# EAGLE design M12-Signalinverter (EAGLE 7.7.0)
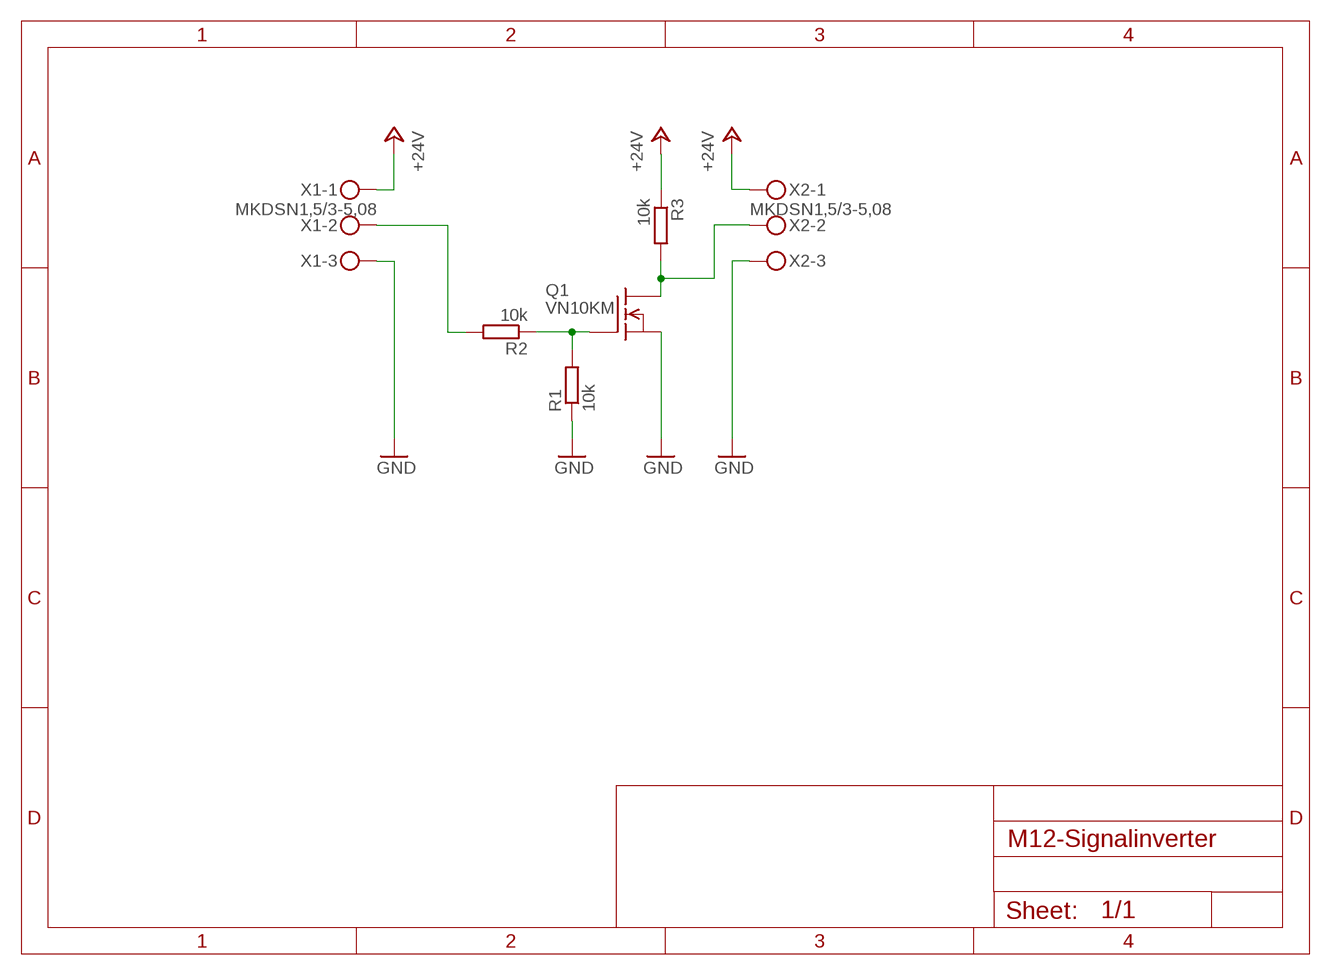
[diagram p0: schematic, sheet 1]

## Parts
Q1  VN10KM  [TO237]
R1  10k  R-EU_0207/7  [0207/7]
R2  10k  R-EU_0207/7  [0207/7]
R3  10k  R-EU_0207/7  [0207/7]
X1  MKDSN1,5/3-5,08  [MKDSN1,5/3-5,08]
X2  MKDSN1,5/3-5,08  [MKDSN1,5/3-5,08]

## Nets
+24V: R3.1 X1.1 X2.1
GND: Q1.3(S) R1.1 X1.3 X2.3
N$2: Q1.1(D) R3.2 X2.2
N$3: Q1.2(G) R1.2 R2.1
N$4: R2.2 X1.2

## Library data of the parts
Q1 = transistor-fet:VN10KM: N-Channel Enhancement MOSFET (VMOS); 60V; 0,5A; 5,0Ohm
R1-R3 = rcl:R-EU_: RESISTOR, European symbol
X1 X2 = con-phoenix-508:MKDSN1,5/3-5,08: MKDSN 1,5/ 3-5,08 Printklemme Nennstrom: 13,5 A Nennspannung: 250 V Rastermaß: 5,08 mm Polzahl: 3 Anschlussart: Schraubanschluss Montage: Löten Anschlussrichtung Leiter/Platine: 0 ° Artikelnummer: 1729131 Source: http://eshop.phoenixcontact.com .. 1729131.pdf

## Board
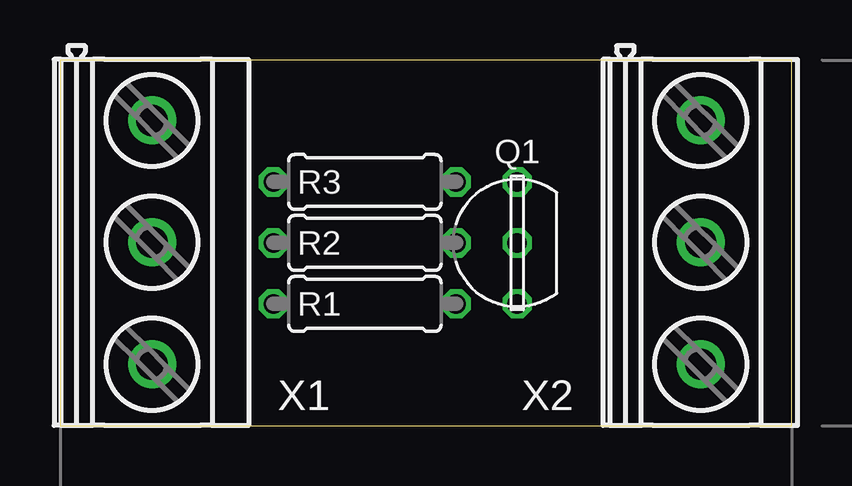
[diagram p1: board, top side]
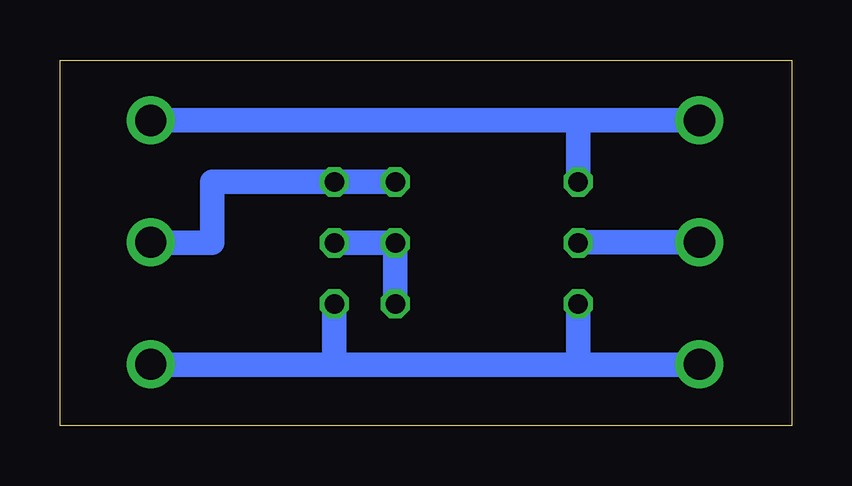
[diagram p2: board, bottom side, seen from below]

Size 30.48 x 15.24 mm. Coordinates in mm from the lower left corner, seen from the top.
Outline: 0,0 30.48,0 30.48,15.24 0,15.23 0,0
Copper layers (1*16): Top 0.0356mm / dielectric 1.5011mm / Bottom 0.0356mm
Design rules "OSH-Park": minimum track width 6mil, minimum drill 13mil, track to track 6mil, track to pad 6mil, pad to pad 6mil, via to via 6mil, smd to smd 6mil, copper to edge 15mil, drill to drill 6mil, minimum pad ring 7mil, minimum via ring 7mil, stop-mask expansion 3mil, vias tented up to drill 0mil, thermal gap 10mil

### Footprints (pad centres in the part's own frame; a part is rotated, then mirrored left to right if it is on the bottom)
TO237 = drill 0.813 octagon: 1 2.54,0; 2 0,0; 3 -2.54,0
0207/7 = drill 0.813 octagon: 1 -3.81,0; 2 3.81,0
MKDSN1,5/3-5,08 = drill 1.3 pad 2: 1 -7.641,0.025; 2 -2.561,0.025; 3 2.519,0.025

### Placement (x,y rotation side)
Q1  19.05,7.62 90 top
R1  12.7,5.08 0 top
R2  12.7,7.62 180 top
R3  12.7,10.16 0 top
X1  3.81,5.08 270 top
X2  26.67,5.08 270 top

### Tracks (layer width: path | path; a pad name or v marks a point on that pad's centre or on a via)
+24V
  Bottom 1.016: X1.1 8.89,12.72 | 8.89,12.72 X2.1 | R3.1 8.89,12.72
GND
  Bottom 0.406: 3.83,2.54 X1.3 | 26.7,2.54 X2.3
  Bottom 1.016: 8.89,2.54 19.05,2.54 | R1.1 8.89,2.54 | 8.89,2.54 3.83,2.54 | Q1.3 19.05,2.54 | 19.05,2.54 26.7,2.54
N$2
  Bottom 0.406: 26.7,7.62 X2.2
  Bottom 1.016: 26.7,7.62 24.13,7.62 24.13,10.16 Q1.1 R3.2
N$3
  Bottom 1.016: R1.2 R2.1 Q1.2
N$4
  Bottom 0.406: 8.89,7.64 R2.2
  Bottom 1.016: X1.2 8.89,7.64

### Text on the board
tDocu: Gehäuse / Hammond 1591LSBK / Bopla 03210000 | Sensor | Steuerung | Braun | Braun | Schwarz | Schwarz | Blau | Blau